# Altium schematic sheet SolarCharger.SchDoc
size A4; DocumentNumber: 2; SheetNumber: 2; SheetTotal: 8
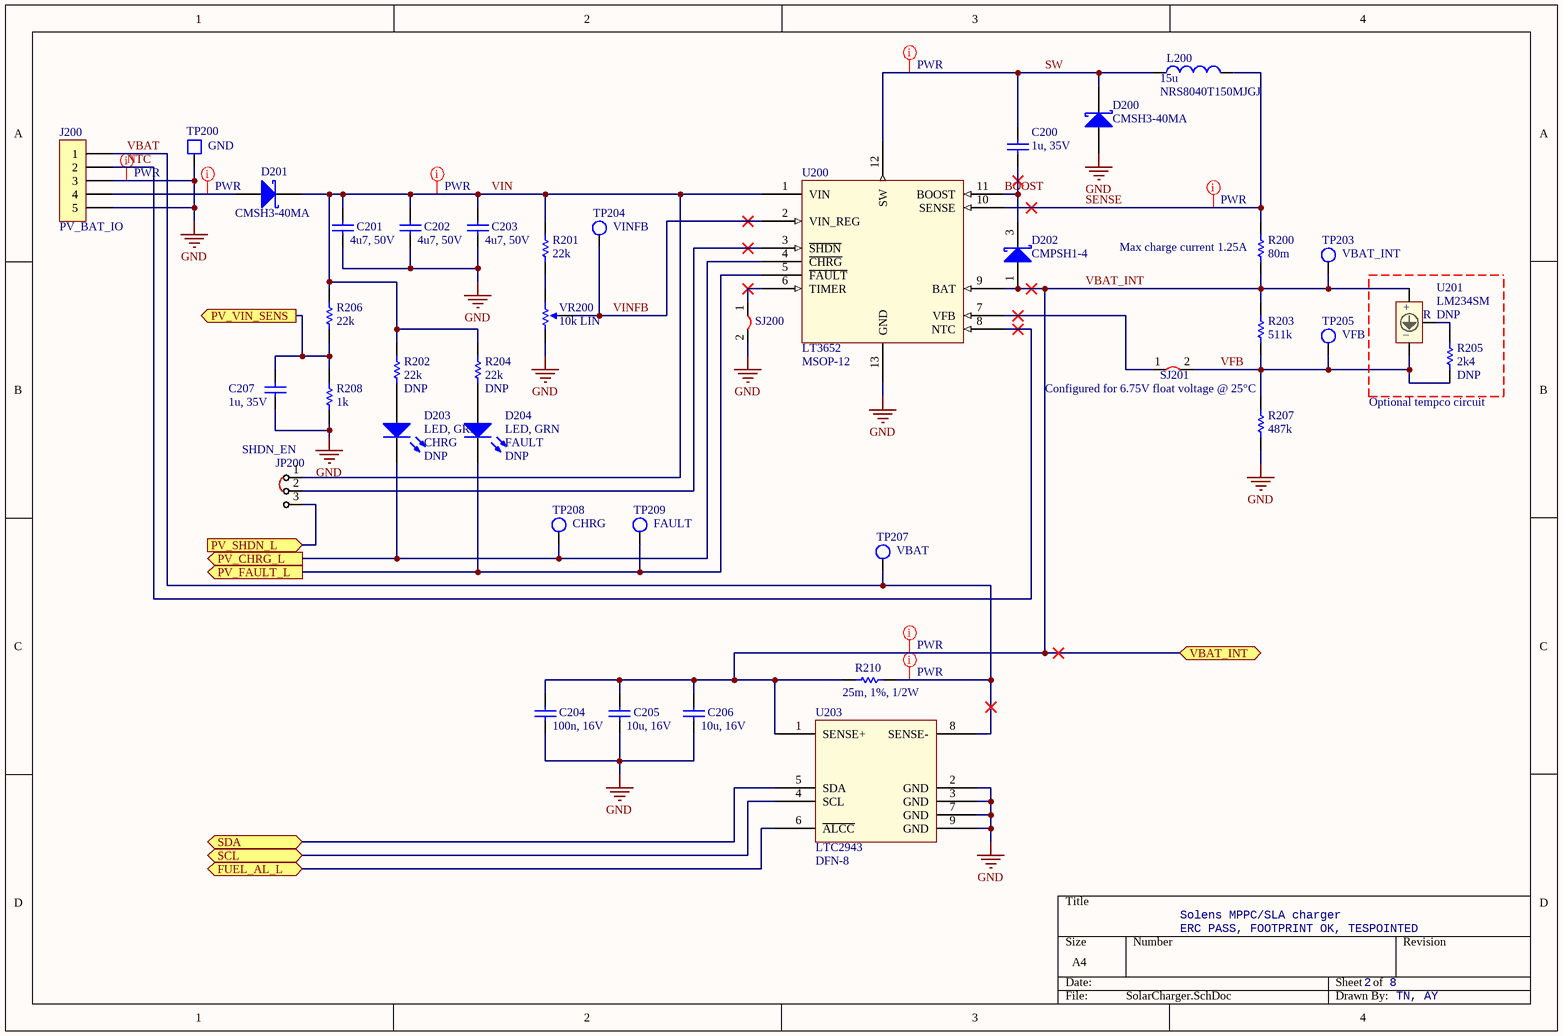
[diagram p0: SolarCharger.SchDoc]

## Parts
C200  value 1u, 35V  [CAP_0805]  (hidden comment: 1u, 35V, 0805)
C201  value 4u7, 50V  [CAP_1210]  (hidden comment: 4u7, 50V, 1210)
C202  value 4u7, 50V  [CAP_1210]  (hidden comment: 4u7, 50V, 1210)
C203  value 4u7, 50V  [CAP_1210]  (hidden comment: 4u7, 50V, 1210)
C204  value 100n, 16V  [CAP_0402]  (hidden comment: 100n, 16V, 0402)
C205  value 10u, 16V  [CAP_1206]  (hidden comment: 10u, 16V, 1206)
C206  value 10u, 16V  [CAP_1206]  (hidden comment: 10u, 16V, 1206)
C207  value 1u, 35V  [CAP_0805]  (hidden comment: 1u, 35V, 0805 (DNP))
D200  PartNumber: CMSH3-40MA  [SODFL519X262-2N (CMSH3-40MA)]  (hidden comment: CMSH3-40MA, DO-214AC)
D201  PartNumber: CMSH3-40MA  [SODFL519X262-2N (CMSH3-40MA)]  (hidden comment: CMSH3-40MA, DO-214AC)
D202  PartNumber: CMPSH1-4  [SOT95P240X100-3N (CMPSH1-4 TR)]  (hidden comment: CMPSH1-4, SOT-23F)
D203  value LED, GRN  Function: CHRG  [LED_0603]  (hidden comment: LED, GRN, 0603 (DNP))
D204  value LED, GRN  Function: FAULT  [LED_0603]  (hidden comment: LED, GRN, 0603 (DNP))
J200  Function: PV_BAT_IO  [691322110005]  (hidden comment: 691322110005, 5p 3.5mm Euro)
JP200  Function: SHDN_EN  [HDR_100TH_1x3]  (hidden comment: HDR_1x3_100TH_THT)
L200  value 15u  [IND_TAIYO_NRS804]  (hidden comment: NRS8040T150MJGJ)
R200  value 80m  [RES_1206]  (hidden comment: 80m, 1/4W, 1%, 1206)
R201  value 22k  [RES_0805]  (hidden comment: 22k, 1/8W, 0805)
R202  value 22k  [RES_0805]  (hidden comment: 22k, 1/8W, 0805)
R203  value 511k  [RES_0805]  (hidden comment: 511k, 1/8W, 0805)
R204  value 22k  [RES_0805]  (hidden comment: 22k, 1/8W, 0805)
R205  value 2k4  [RES_0805]  (hidden comment: 2k4, 1/8W, 0805 (DNP))
R206  value 22k  [RES_0805]  (hidden comment: 22k, 1/8W, 0805)
R207  value 487k  [RES_0805]  (hidden comment: 487k, 1/8W, 0805)
R208  value 1k  [RES_0805]  (hidden comment: 1k, 1/8W, 0805)
R210  value 25m, 1%, 1/2W  [RES_1206]  (hidden comment: 25m, 1/2W, 1%, 1206)
SJ200  SJ, 0805 (DNP)  [SJ_0805]  (value not drawn)
SJ201  SJ, 0805 (DNP)  [SJ_0805]  (value not drawn)
TP200  VisibleNetName: GND  [TP_LARGE]  (hidden comment: TP (DNP))
TP203  VisibleNetName: VBAT_INT  [TP_SMALL]  (hidden comment: TP (DNP))
TP204  VisibleNetName: VINFB  [TP_SMALL]  (hidden comment: TP (DNP))
TP205  VisibleNetName: VFB  [TP_SMALL]  (hidden comment: TP (DNP))
TP207  VisibleNetName: VBAT  [TP_SMALL]  (hidden comment: TP (DNP))
TP208  VisibleNetName: CHRG  [TP_SMALL]  (hidden comment: TP (DNP))
TP209  VisibleNetName: FAULT  [TP_SMALL]  (hidden comment: TP (DNP))
U200  PackageName: MSOP-12  [TSOP65P490X110_HS-13N (LT3652)]  (hidden comment: LT3652, MSOP-12)
U201  value LM234SM  [SOIC127P600X175-8N (LM234)]  (hidden comment: LM234SM, SOIC-8 (DNP))
U203  PartNumber: LTC2943  PackageName: DFN-8  [DFN8-3x3]  (hidden comment: LTC2943, DFN-8)
VR200  value 10k LIN  [RES_3361P]  (hidden comment: 3361P-1-103GLF)

## Ports
FUEL_AL_L (bidir), PV_CHRG_L (out), PV_FAULT_L (out), PV_SHDN_L (in), PV_VIN_SENS (out), SCL (bidir), SDA (bidir), VBAT_INT

## Nets
GND: C201.2 C202.2 C203.2 C204.2 C205.2 C206.2 C207.2 D200.1(A) J200.3 J200.5 R207.2 R208.2 SJ200.2 TP200.1 U200.13(GND) U203.2(GND) U203.3(GND) U203.7(GND) U203.9(GND) VR200.2
BOOST: C200.2 D202.3(K) U200.11(BOOST)
FUEL_AL_L: U203.6(~{ALCC}) ; port FUEL_AL_L
NTC: J200.2 U200.8(NTC)
PV_CHRG_L: D203.2(K) TP208.1 U200.4(~{CHRG}) ; port PV_CHRG_L
PV_FAULT_L: D204.2(K) TP209.1 U200.5(~{FAULT}) ; port PV_FAULT_L
PV_SHDN_L: JP200.3 ; port PV_SHDN_L
PV_VIN_SENS: C207.1 R206.2 R208.1 ; port PV_VIN_SENS
SCL: U203.4(SCL) ; port SCL
SDA: U203.5(SDA) ; port SDA
SENSE: L200.2 R200.2 U200.10(SENSE)
SW: C200.1 D200.2(K) L200.1 U200.12(SW)
VBAT: J200.1 R210.2 TP207.1 U203.8(SENSE-)
VBAT_INT: C204.1 C205.1 C206.1 D202.1(A) R200.1 R203.1 R210.1 TP203.1 U200.9(BAT) U201.3(V+) U203.1(SENSE+) ; port VBAT_INT
VFB: R203.2 R205.2 R207.1 SJ201.2 TP205.1 U201.1(V-)
VIN: C201.1 C202.1 C203.1 D201.2(K) JP200.1 R201.1 R202.1 R204.1 R206.1 U200.1(VIN)
VINFB: TP204.1 U200.2(VIN_REG) VR200.3
NetD201_1: D201.1(A) J200.4
NetD203_1: D203.1(A) R202.2
NetD204_1: D204.1(A) R204.2
NetJP200_2: JP200.2 U200.3(~{SHDN})
NetR201_2: R201.2 VR200.1
NetR205_1: R205.1 U201.2(R)
NetSJ200_1: SJ200.1 U200.6(TIMER)
NetSJ201_1: SJ201.1 U200.7(VFB)

## Layout directives
net class PWR: GND, NetD201_1, SENSE, SW, VBAT, VBAT_INT, VIN

## Notes on the sheet
- (near R200) Max charge current 1.25A
- Configured for 6.75V float voltage @ 25°C
- (near R205) Optional tempco circuit
- Solens MPPC/SLA charger
- ERC PASS, FOOTPRINT OK, TESPOINTED
- TN, AY
- (in symbol LM234) +; –

## Library data of the parts
C200-C207 = Cap: Capacitor
  C200: DigikeyPN: 1276-6470-1-ND
  C201-C203: DigikeyPN: 1276-3343-1-ND
  C204: DigikeyPN: 587-3498-1-ND
  C205 C206: DigikeyPN: 1276-1312-1-ND
  C207: DigikeyPN: 1276-6470-1-ND; DNP: DNP
D200-D202 = D Schottky: Schottky Diode
  D200 D201: PackageName: DO-214AC (SMA); DigikeyPN: CMSH3-40MA TR13CT-ND; Value: CMSH3-40MA
  D202: PackageName: SOT-23F; DigikeyPN: CMPSH1-4 CT-ND; Value: CMPSH1-4
D203 D204 = LED0: DigikeyPN: 732-4971-1-ND; DNP: DNP
J200 = 691322110005: WR-TBL Terminal block - serie 3221 - 3.50 mm; Manufacturer: Würth Elektronik eiSos GmbH; ComponentLink1 Description: Manufacturer; ComponentLink2 Description: Datasheet; NoPins: 5; Created Date: 9 December 2013; ComponentLink1URL: http://www.we-online.com; ComponentLink2URL: http://katalog.we-online.de/em/datasheet/6913221100xx.pdf; Created by: Karrer Zheng; DigikeyPN: 732-2772-ND; PartNumber: 691322110005; Value: 691322110005
JP200 = JP-3: 3-pos Jumper; DigikeyPN: 732-5316-ND; Value: HDR_1x3_100TH_THT
L200 = Inductor: PartNumber: NRS8040T150MJGJ; DigikeyPN: 587-2973-1-ND
R200-R208 R210 = Res1: Resistor
  R200: DigikeyPN: WSLC-.08CT-ND
  R201: DigikeyPN: 311-22.0KCRCT-ND
  R202 R204 R206: DigikeyPN: 311-22.0KCRCT-ND; DNP: DNP
  R203: DigikeyPN: 311-511KCRCT-ND
  R205: DNP: DNP
  R207: DigikeyPN: 311-487KCRCT-ND
  R208: DigikeyPN: 311-1.00KCRCT-ND; DNP: DNP
  R210: DigikeyPN: CSR1206FK25L0CT-ND
SJ200 SJ201 = SJ: Solder jumper; Value: SJ_0805 (DNP); DNP: DNP
TP200 = TP_LARGE: Value: TP_LARGE (DNP); DigikeyPN: 36-5016CT-ND; DNP: DNP
TP203-TP205 TP207-TP209 = TP_SMALL: Value: TP_SMALL (DNP); DigikeyPN: 36-5015CT-ND; DNP: DNP
U200 = LT3652: MPPC and battery charger; PartNumber: LT3652; DigikeyPN: LT3652EMSE#PBF-ND; Value: LT3652
U201 = LM234: Adjustable current source; PartNumber: LM234SM; PackageName: SOIC-8; DigikeyPN: 497-1549-1-ND; DNP: DNP
U203 = LTC2943A: Multi-cell I2C fuel gauge; DigikeyPN: LTC2943IDD#PBF-ND; Value: LTC2943
VR200 = TrimPot: Function: VIN SET; DigikeyPN: 3361P-103GLFCT-ND; PartNumber: 3361P-1-103GLF